# Altium schematic sheet 2_cubesat_bus.SchDoc: CubeSat Bus interface
size A4; OrganizationName: Pluton UPV; Address1: Universitat Politècnica; Address2: de València (UPV); Address3: Camí de Vera, València; Address4: Spain; SheetNumber: 2; SheetTotal: 12
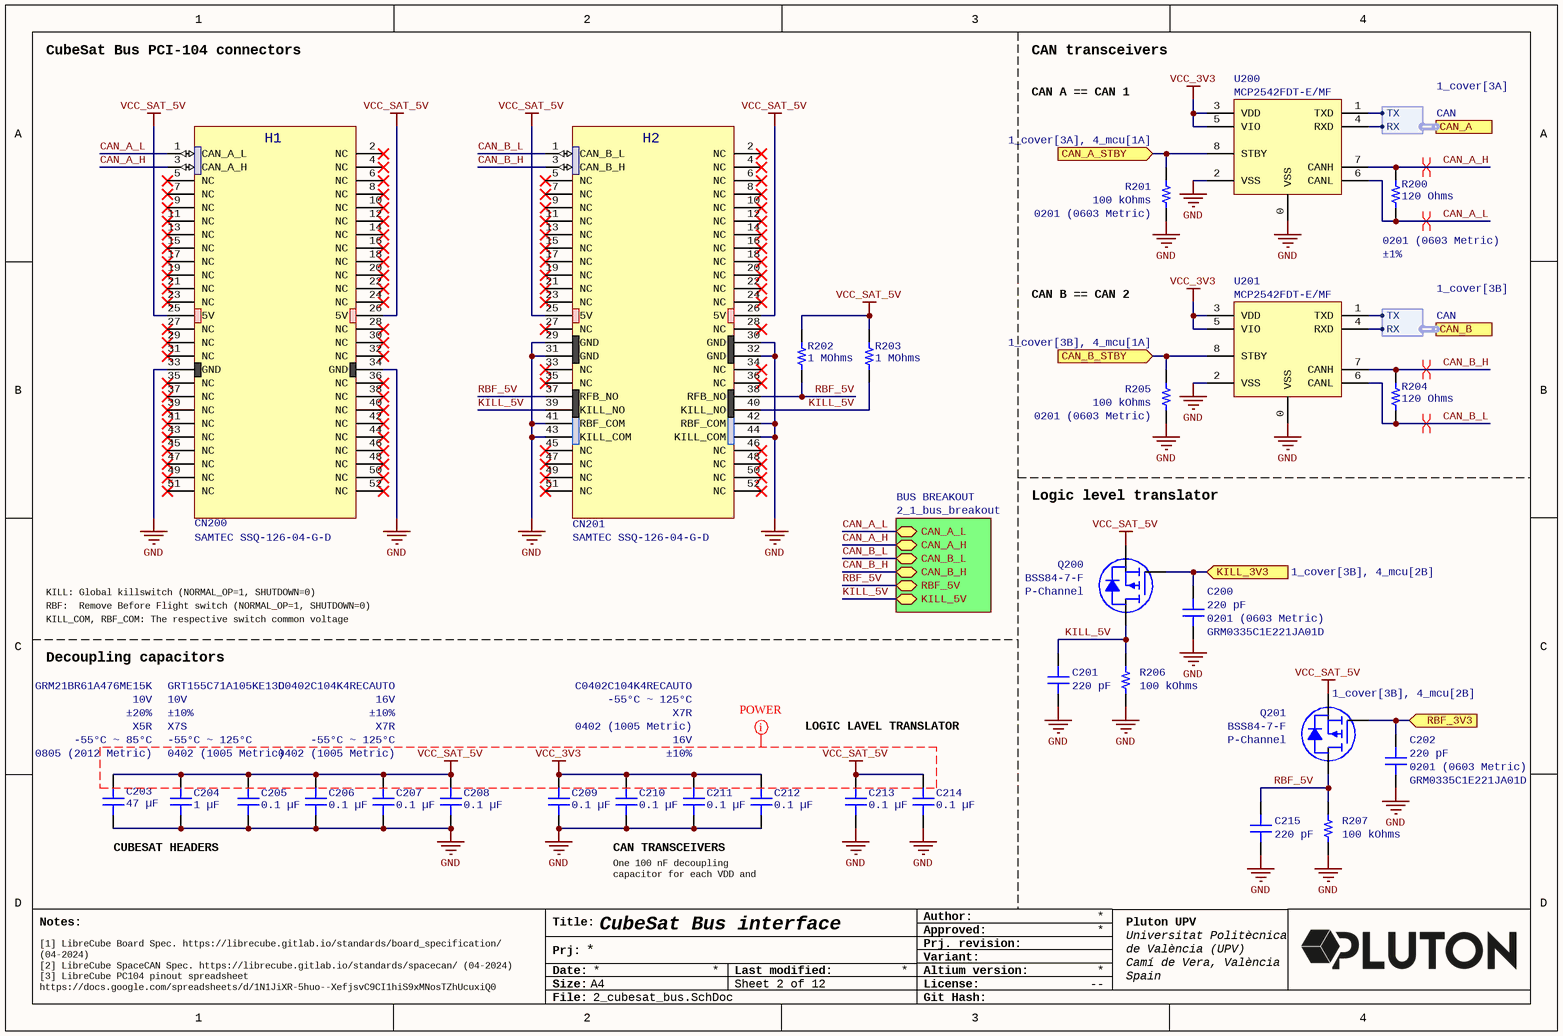
[diagram p0: 2_cubesat_bus.SchDoc]

## Parts
C200  220 pF  Part Number: GRM0335C1E221JA01D  Device Package: 0201 (0603 Metric)  [CAP 0201_0603]
C201  220 pF  [CAP 0201_0603]
C202  220 pF  Part Number: GRM0335C1E221JA01D  Device Package: 0201 (0603 Metric)  [CAP 0201_0603]
C203  Part Number: GRM21BR61A476ME15K  Device Package: 0805 (2012 Metric)  Operating Temperature: -55°C ~ 85°C  Temperature Coefficient: X5R  Tolerance: ±20%  Voltage - Rated: 10V  [CAP 0805_2012]  (hidden comment: 47 µF)
C204  Part Number: GRT155C71A105KE13D  Device Package: 0402 (1005 Metric)  Operating Temperature: -55°C ~ 125°C  Temperature Coefficient: X7S  Tolerance: ±10%  Voltage - Rated: 10V  [CAP 0402_1005]  (hidden comment: 1 µF)
C205  Part Number: C0402C104K4RECAUTO  Operating Temperature: -55°C ~ 125°C  Package / Case: 0402 (1005 Metric)  Temperature Coefficient: X7R  Tolerance: ±10%  Voltage - Rated: 16V  [CAP 0402_1005]  (hidden comment: 0.1 µF)
C206  0.1 µF  [CAP 0402_1005]
C207  0.1 µF  [CAP 0402_1005]
C208  0.1 µF  [CAP 0402_1005]
C209  0.1 µF  [CAP 0402_1005]
C210  Part Number: C0402C104K4RECAUTO  Operating Temperature: -55°C ~ 125°C  Package / Case: 0402 (1005 Metric)  Temperature Coefficient: X7R  Tolerance: ±10%  Voltage - Rated: 16V  [CAP 0402_1005]  (hidden comment: 0.1 µF)
C211  0.1 µF  [CAP 0402_1005]
C212  0.1 µF  [CAP 0402_1005]
C213  0.1 µF  [CAP 0402_1005]
C214  0.1 µF  [CAP 0402_1005]
C215  220 pF  [CAP 0201_0603]
CN200  SAMTEC SSQ-126-04-G-D  [SAMTEC SSQ-126-04-G-D]
CN201  SAMTEC SSQ-126-04-G-D  [SAMTEC SSQ-126-04-G-D]
Q200  FET Type: P-Channel  [DIODES SOT-23-3]  (hidden comment: BSS84-7-F)
Q201  FET Type: P-Channel  [DIODES SOT-23-3]  (hidden comment: BSS84-7-F)
R200  Device Package: 0201 (0603 Metric)  Tolerance: ±1%  [RES 0201_0603]  (hidden comment: 120 Ohms)
R201  Device Package: 0201 (0603 Metric)  [RES 0201_0603]  (hidden comment: 100 kOhms)
R202  1 MOhms  [RES 0201_0603]
R203  1 MOhms  [RES 0201_0603]
R204  120 Ohms  [RES 0201_0603]
R205  Device Package: 0201 (0603 Metric)  [RES 0201_0603]  (hidden comment: 100 kOhms)
R206  100 kOhms  [RES 0201_0603]
R207  100 kOhms  [RES 0201_0603]
U200  MCP2542FDT-E/MF  [DFN-8 3x3mm]
U201  MCP2542FDT-E/MF  [DFN-8 3x3mm]

## Sub-sheets
BUS BREAKOUT = 2_1_bus_breakout: CAN_A_L (bidir), CAN_A_H (bidir), CAN_B_L (bidir), CAN_B_H (bidir), RBF_5V (bidir), KILL_5V (bidir)

## Ports
CAN_A (harness CAN, see 1_cover[3A]), CAN_A_STBY (in, see 1_cover[3A], 4_mcu[1A]), CAN_B (harness CAN, see 1_cover[3B]), CAN_B_STBY (in, see 1_cover[3B], 4_mcu[1A]), KILL_3V3 (in, see 1_cover[3B], 4_mcu[2B]), RBF_3V3 (in, see 1_cover[3B], 4_mcu[2B])

## Harnesses
CAN: RX, TX

## Nets
GND: C200.1 C201.1 C202.1 C203.1 C204.1 C205.1 C206.1 C207.1 C208.1 C209.1 C210.1 C211.1 C212.1 C213.1 C214.1 C215.1 CN200.33(GND) CN200.34(GND) CN201.29(GND) CN201.30(GND) CN201.31(GND) CN201.32(GND) CN201.41(RBF_COM) CN201.42(RBF_COM) CN201.43(KILL_COM) CN201.44(KILL_COM) R201.1 R205.1 R206.2 R207.2 U200.0(VSS) U200.2(VSS) U201.0(VSS) U201.2(VSS)
VCC_3V3: C209.2 C210.2 C211.2 C212.2 U200.3(VDD) U200.5(VIO) U201.3(VDD) U201.5(VIO)
VCC_SAT_5V: C203.2 C204.2 C205.2 C206.2 C207.2 C208.2 C213.2 C214.2 CN200.25(5V) CN200.26(5V) CN201.25(5V) CN201.26(5V) Q200.2(S) Q201.2(S) R202.2 R203.2
CAN_A_H: CN200.3(CAN_A_H) R200.2 U200.7(CANH) ; sheet BUS BREAKOUT/CAN_A_H
CAN_A_L: CN200.1(CAN_A_L) R200.1 U200.6(CANL) ; sheet BUS BREAKOUT/CAN_A_L
CAN_A_STBY: R201.2 U200.8(STBY) ; port CAN_A_STBY
CAN_B_H: CN201.3(CAN_B_H) R204.2 U201.7(CANH) ; sheet BUS BREAKOUT/CAN_B_H
CAN_B_L: CN201.1(CAN_B_L) R204.1 U201.6(CANL) ; sheet BUS BREAKOUT/CAN_B_L
CAN_B_STBY: R205.2 U201.8(STBY) ; port CAN_B_STBY
KILL_3V3: C200.2 Q200.1(G) ; port KILL_3V3
KILL_5V: C201.2 CN201.39(KILL_NO) CN201.40(KILL_NO) Q200.3(D) R203.1 R206.1 ; sheet BUS BREAKOUT/KILL_5V
RBF_3V3: C202.2 Q201.1(G) ; port RBF_3V3
RBF_5V: C215.2 CN201.37(RFB_NO) CN201.38(RFB_NO) Q201.3(D) R202.1 R207.1 ; sheet BUS BREAKOUT/RBF_5V
NetU200_1: U200.1(TXD) ; port CAN_A.TX
NetU200_4: U200.4(RXD) ; port CAN_A.RX
NetU201_1: U201.1(TXD) ; port CAN_B.TX
NetU201_4: U201.4(RXD) ; port CAN_B.RX

Not connected (* = marked no-connect by the designer): CN200 2(NC)* 4(NC)* 5(NC)* 6(NC)* 7(NC)* 8(NC)* 9(NC)* 10(NC)* 11(NC)* 12(NC)* 13(NC)* 14(NC)* 15(NC)* 16(NC)* 17(NC)* 18(NC)* 19(NC)* 20(NC)* 21(NC)* 22(NC)* 23(NC)* 24(NC)* 27(NC)* 28(NC)* 29(NC)* 30(NC)* 31(NC)* 32(NC)* 35(NC)* 36(NC)* 37(NC)* 38(NC)* 39(NC)* 40(NC)* 41(NC)* 42(NC)* 43(NC)* 44(NC)* 45(NC)* 46(NC)* 47(NC)* 48(NC)* 49(NC)* 50(NC)* 51(NC)* 52(NC)*; CN201 2(NC)* 4(NC)* 5(NC)* 6(NC)* 7(NC)* 8(NC)* 9(NC)* 10(NC)* 11(NC)* 12(NC)* 13(NC)* 14(NC)* 15(NC)* 16(NC)* 17(NC)* 18(NC)* 19(NC)* 20(NC)* 21(NC)* 22(NC)* 23(NC)* 24(NC)* 27(NC)* 28(NC)* 33(NC)* 34(NC)* 35(NC)* 36(NC)* 45(NC)* 46(NC)* 47(NC)* 48(NC)* 49(NC)* 50(NC)* 51(NC)* 52(NC)*

## Layout directives
differential pair: CAN_A_H, CAN_A_L, CAN_B_H, CAN_B_L
rule Width Constraint [Pref Width = 0.4mm    Min Width = 0.3mm    Max Width = 0.5mm]; net class POWER: VCC_3V3, VCC_SAT_5V

## Notes on the sheet
- CubeSat Bus PCI-104 connectors
- CAN transceivers
- CAN A == CAN 1
- CAN B == CAN 2
- Logic level translator
- RBF:  Remove Before Flight switch (NORMAL_OP=1, SHUTDOWN=0)
- KILL: Global killswitch (NORMAL_OP=1, SHUTDOWN=0)
- KILL_COM, RBF_COM: The respective switch common voltage
- Decoupling capacitors
- LOGIC LAVEL TRANSLATOR
- CUBESAT HEADERS
- CAN TRANSCEIVERS
- One 100 nF decoupling capacitor for each VDD and VIO pins [4]
- [1] LibreCube Board Spec. https://librecube.gitlab.io/standards/board_specification/ (04-2024)
  [2] LibreCube SpaceCAN Spec. https://librecube.gitlab.io/standards/spacecan/ (04-2024)
  [3] LibreCube PC104 pinout spreadsheet
  https://docs.google.com/spreadsheets/d/1N1JiXR-5huo--XefjsvC9CI1hiS9xMNosTZhUcuxiQ0 (04-2024)
  [4] Microchip Inc. MCP2542FD/4FD MCP2542WFD/4WFD datasheet, DS20005514C, 2020
- Notes:
- Title:
- Author:
- Approved:
- Date:
- Prj:
- Size:
- A4
- Last modified:
- Altium version:
- Variant:
- Prj. revision:
- License:
- --
- File:
- Git Hash:
- (in symbol CubeSat Header H1 LoRa PL) H1
- (in symbol CubeSat Header H2 LoRa PL) H2

## Library data of the parts
C200-C202 C215 = GRM0335C1E221JA01D: CAP CER 220PF 25V C0G/NP0 0201; manufacturer: Murata Electronics; Temperature Coefficient: C0G, NP0; Tolerance: ±5%; Value: 220 pF; Applications: General Purpose; Capacitance: 220 pF; componentlink2description: DigiKey Link; componentlink2url: https://www.digikey.com/en/products/detail/murata-electronics/GRM0335C1E221JA01D/10697031; lastupdated: 04/06/2024 19:01:01; Lifecycle Status: Active; Minimum Order: 1; Mounting Type: Surface Mount, MLCC; Operating Temperature: -55°C ~ 125°C; Package / Case: 0201 (0603 Metric); packaging: CutTape; partid: 46083; Part Status: Active; price: 0.01; series: GRM; Size / Dimension: 0.024" L x 0.012" W (0.60mm x 0.30mm); Supplier 1: DigiKey; Supplier Part Number 1: 490-GRM0335C1E221JA01DCT-ND; Thickness (Max): 0.013" (0.33mm); Voltage - Rated: 25V
  C201 C215: Part Number: GRM0335C1E221JA01D; Device Package: 0201 (0603 Metric)
C203 = GRM21BR61A476ME15K: CAP CER 47UF 10V X5R 0805; manufacturer: Murata Electronics; Value: 47 µF; Applications: General Purpose; Capacitance: 47 µF; componentlink1description: Datasheet; componentlink1url: https://www.murata.com/-/media/webrenewal/support/library/catalog/products/capacitor/ceramiccapacitor/c02e.ashx?la=en-us&cvid=20210120024548000000; componentlink2description: DigiKey Link; componentlink2url: https://www.digikey.com/en/products/detail/murata-electronics/GRM21BR61A476ME15K/4905528; lastupdated: 09/02/2024 20:14:59; Lifecycle Status: Active; Minimum Order: 1; Mounting Type: Surface Mount, MLCC; Package / Case: 0805 (2012 Metric); packaging: TapeAndReel; partid: 44285; Part Status: Active; price: 0.13; series: GRM; Size / Dimension: 0.079" L x 0.049" W (2.00mm x 1.25mm); Supplier 1: DigiKey; Supplier Part Number 1: 490-GRM21BR61A476ME15KCT-ND; Thickness (Max): 0.057" (1.45mm)
C204 = GRT155C71A105KE13D: CAP CER 1UF 10V X7S 0402; manufacturer: Murata Electronics; Value: 1 µF; Applications: Automotive; Capacitance: 1 µF; componentlink1description: Datasheet; componentlink1url: https://search.murata.co.jp/Ceramy/image/img/A01X/G101/ENG/GRT155C71A105KE13-01.pdf; componentlink2description: DigiKey Link; componentlink2url: https://www.digikey.com/en/products/detail/murata-electronics/GRT155C71A105KE13D/10695747; lastupdated: 09/02/2024 20:04:05; Lifecycle Status: Active; Minimum Order: 1; Mounting Type: Surface Mount, MLCC; Package / Case: 0402 (1005 Metric); packaging: TapeAndReel; partid: 47127; Part Status: Active; price: 0.04; Ratings: AEC-Q200; series: GRT; Size / Dimension: 0.039" L x 0.020" W (1.00mm x 0.50mm); Supplier 1: DigiKey; Supplier Part Number 1: 490-GRT155C71A105KE13DCT-ND; Thickness (Max): 0.024" (0.60mm)
C205-C214 = C0402C104K4RECAUTO: CAP CER 0402 0.1UF 16V X7R 10%; manufacturer: KEMET; Value: 0.1 µF; Applications: Automotive, ESD Protection; Capacitance: 0.1 µF; componentlink1description: Datasheet; componentlink1url: https://api.kemet.com/component-edge/download/datasheet/C0402C104K4RECAUTO.pdf; componentlink2description: DigiKey Link; componentlink2url: https://www.digikey.com/en/products/detail/kemet/C0402C104K4RECAUTO/8563695; Device Package: 0402 (1005 Metric); lastupdated: 09/02/2024 20:04:38; Lifecycle Status: Active; Minimum Order: 1; Mounting Type: Surface Mount, MLCC; packaging: TapeAndReel; partid: 1731; Part Status: Active; price: 0.01; Ratings: AEC-Q200; series: ESD SMD Auto X7R; Size / Dimension: 0.039" L x 0.020" W (1.00mm x 0.50mm); Supplier 1: DigiKey; Supplier Part Number 1: 399-17167-1-ND; Thickness (Max): 0.022" (0.55mm)
  C206-C209 C211-C214: Part Number: C0402C104K4RECAUTO; Operating Temperature: -55°C ~ 125°C; Package / Case: 0402 (1005 Metric); Temperature Coefficient: X7R; Tolerance: ±10%; Voltage - Rated: 16V
CN200 = CubeSat Header H1 LoRa PL: LoRa Payload only pins SAMTEC SSQ-126-04-G-D; System: Connector
CN201 = CubeSat Header H2 LoRa PL: LoRa Payload only pins; System: Connector
Q200 Q201 = BSS84-7-F: MOSFET P-CH 50V 130MA SOT23-3; Manufacturer: Diodes Incorporated; Current - Continuous Drain (Id) @ 25°C: 130mA (Ta); Drive Voltage (Max Rds On,  Min Rds On): 5V; Input Capacitance (Ciss) (Max) @ Vds: 45 pF @ 25 V; Power Dissipation (Max): 300mW (Ta); Rds On (Max) @ Id, Vgs: 10Ohm @ 100mA, 5V; Vgs (Max): ±20V; Vgs(th) (Max) @ Id: 2V @ 1mA; Part Number: BSS84-7-F; ComponentLink1Description: Datasheet; ComponentLink1URL: https://www.diodes.com/assets/Datasheets/ds30149.pdf; ComponentLink2Description: DigiKey Link; ComponentLink2URL: https://www.digikey.com/en/products/detail/diodes-incorporated/BSS84-7-F/717724; Drain to Source Voltage (Vdss): 50 V; LastUpdated: 03/06/2024 20:15:20; Lifecycle Status: Active; Minimum Order: 1; Mounting Type: Surface Mount; Operating Temperature: -55°C ~ 150°C (TJ); Package / Case: TO-236-3, SC-59, SOT-23-3; Packaging: TapeAndReel; Part Status: Active; Price: 0.02; Series: -; Supplier 1: DigiKey; Supplier Part Number 1: BSS84-FDICT-ND; Supplier Device Package: SOT-23-3; Technology: MOSFET (Metal Oxide)
R200 R204 = CRCW0201120RFNED: RES SMD 120 OHM 1% 1/20W 0201; Manufacturer: Vishay Dale; Power (Watts): 0.05W, 1/20W; Temperature Coefficient: ±200ppm/°C; Part Number: CRCW0201120RFNED; Value: 120 Ohms; ComponentLink1Description: Datasheet; ComponentLink1URL: http://www.vishay.com/docs/20052/crcw0201e3.pdf; ComponentLink2Description: DigiKey Link; ComponentLink2URL: https://www.digikey.com/en/products/detail/vishay-dale/CRCW0201120RFNED/1199704; Composition: Thick Film; Height - Seated (Max): 0.010" (0.26mm); LastUpdated: 04/06/2024 19:11:56; Lifecycle Status: Active; Minimum Order: 1; Number of Terminations: 2; Operating Temperature: -55°C ~ 155°C; Package / Case: 0201 (0603 Metric); Packaging: TapeAndReel; PartId: 2072; Part Status: Active; Price: 0.01; Resistance: 120 Ohms; Series: CRCW0201 e3; Size / Dimension: 0.024" L x 0.012" W (0.60mm x 0.30mm); Supplier 1: DigiKey; Supplier Part Number 1: 541-CRCW0201120RFNEDCT-ND; Supplier Device Package: 201
  R204: Device Package: 0201 (0603 Metric); Tolerance: ±1%
R201 R205-R207 = RC0201FR-13100KL: RES 100K OHM 1% 1/20W 0201; Manufacturer: Yageo; Power (Watts): 0.05W, 1/20W; Temperature Coefficient: ±200ppm/°C; Part Number: RC0201FR-13100KL; Value: 100 kOhms; ComponentLink1Description: Datasheet; ComponentLink1URL: https://www.yageo.com/upload/media/product/productsearch/datasheet/rchip/PYu-RC_Group_51_RoHS_L_12.pdf; ComponentLink2Description: DigiKey Link; ComponentLink2URL: https://www.digikey.com/en/products/detail/yageo/RC0201FR-13100KL/17014509; Composition: Thick Film; Features: Moisture Resistant; Height - Seated (Max): 0.010" (0.26mm); LastUpdated: 04/06/2024 19:11:47; Lifecycle Status: Active; Minimum Order: 1; Number of Terminations: 2; Operating Temperature: -55°C ~ 125°C; Package / Case: 0201 (0603 Metric); Packaging: CutTape; PartId: 80199; Price: 0.01; Resistance: 100 kOhms; Series: RC_L; Size / Dimension: 0.024" L x 0.012" W (0.60mm x 0.30mm); Supplier 1: DigiKey; Supplier Part Number 1: 13-RC0201FR-13100KLCT-ND; Supplier Device Package: 0201; Tolerance: ±1%
  R206 R207: Device Package: 0201 (0603 Metric)
R202 R203 = CRCW02011M00JNED: RES SMD 1M OHM 5% 1/20W 0201; Manufacturer: Vishay Dale; Power (Watts): 0.05W, 1/20W; Temperature Coefficient: ±200ppm/°C; Part Number: CRCW02011M00JNED; Value: 1 MOhms; ComponentLink1Description: Datasheet; ComponentLink1URL: http://www.vishay.com/docs/20052/crcw0201e3.pdf; ComponentLink2Description: DigiKey Link; ComponentLink2URL: https://www.digikey.com/en/products/detail/vishay-dale/CRCW02011M00JNED/1199588; Composition: Thick Film; Device Package: 0201 (0603 Metric); Height - Seated (Max): 0.010" (0.26mm); LastUpdated: 04/06/2024 19:12:01; Lifecycle Status: Active; Minimum Order: 1; Number of Terminations: 2; Operating Temperature: -55°C ~ 155°C; Package / Case: 0201 (0603 Metric); Packaging: TapeAndReel; PartId: 493; Part Status: Active; Price: 0.01; Resistance: 1 MOhms; Series: CRCW0201 e3; Size / Dimension: 0.024" L x 0.012" W (0.60mm x 0.30mm); Supplier 1: DigiKey; Supplier Part Number 1: 541-CRCW02011M00JNEDCT-ND; Supplier Device Package: 201; Tolerance: ±5%
U200 U201 = CAN MCP2542FDT-E/MF: IC TRANSCEIVER 1/1 8DFN; Manufacturer: Microchip Technology; Data Rate: 8Mbps; Protocol: CANbus; Receiver Hysteresis: 200mV; Voltage - Supply: 4.5V ~ 5.5V; ComponentLink1Description: Datasheet; ComponentLink1URL: http://www.microchip.com/mymicrochip/filehandler.aspx?ddocname=en585412; ComponentLink2Description: DigiKey Link; ComponentLink2URL: http://digikey.com/product-detail/en/microchip-technology/MCP2542FDT-E-MF/MCP2542FDT-E-MFCT-ND/5975779; Device Package: 8-VDFN Exposed Pad; LastUpdated: 24/05/2020 23:09:12; Lifecycle Status: Active; Minimum Order: 1; Mounting Type: Surface Mount; Number of Drivers/Receivers: 1/1; Operating Temperature: -40°C ~ 125°C; Package / Case: 8-VDFN Exposed Pad; Packaging: TapeAndReel; Part Status: Active; Price: 0.62; Series: -; Supplier 1: DigiKey; Supplier Part Number 1: MCP2542FDT-E/MFCT-ND; Supplier Device Package: 8-DFN (3x3); Type: Transceiver; Part Number: MCP2542FDT-E/MF